# EAGLE schematic UniTerm (EAGLE 7.1.0)
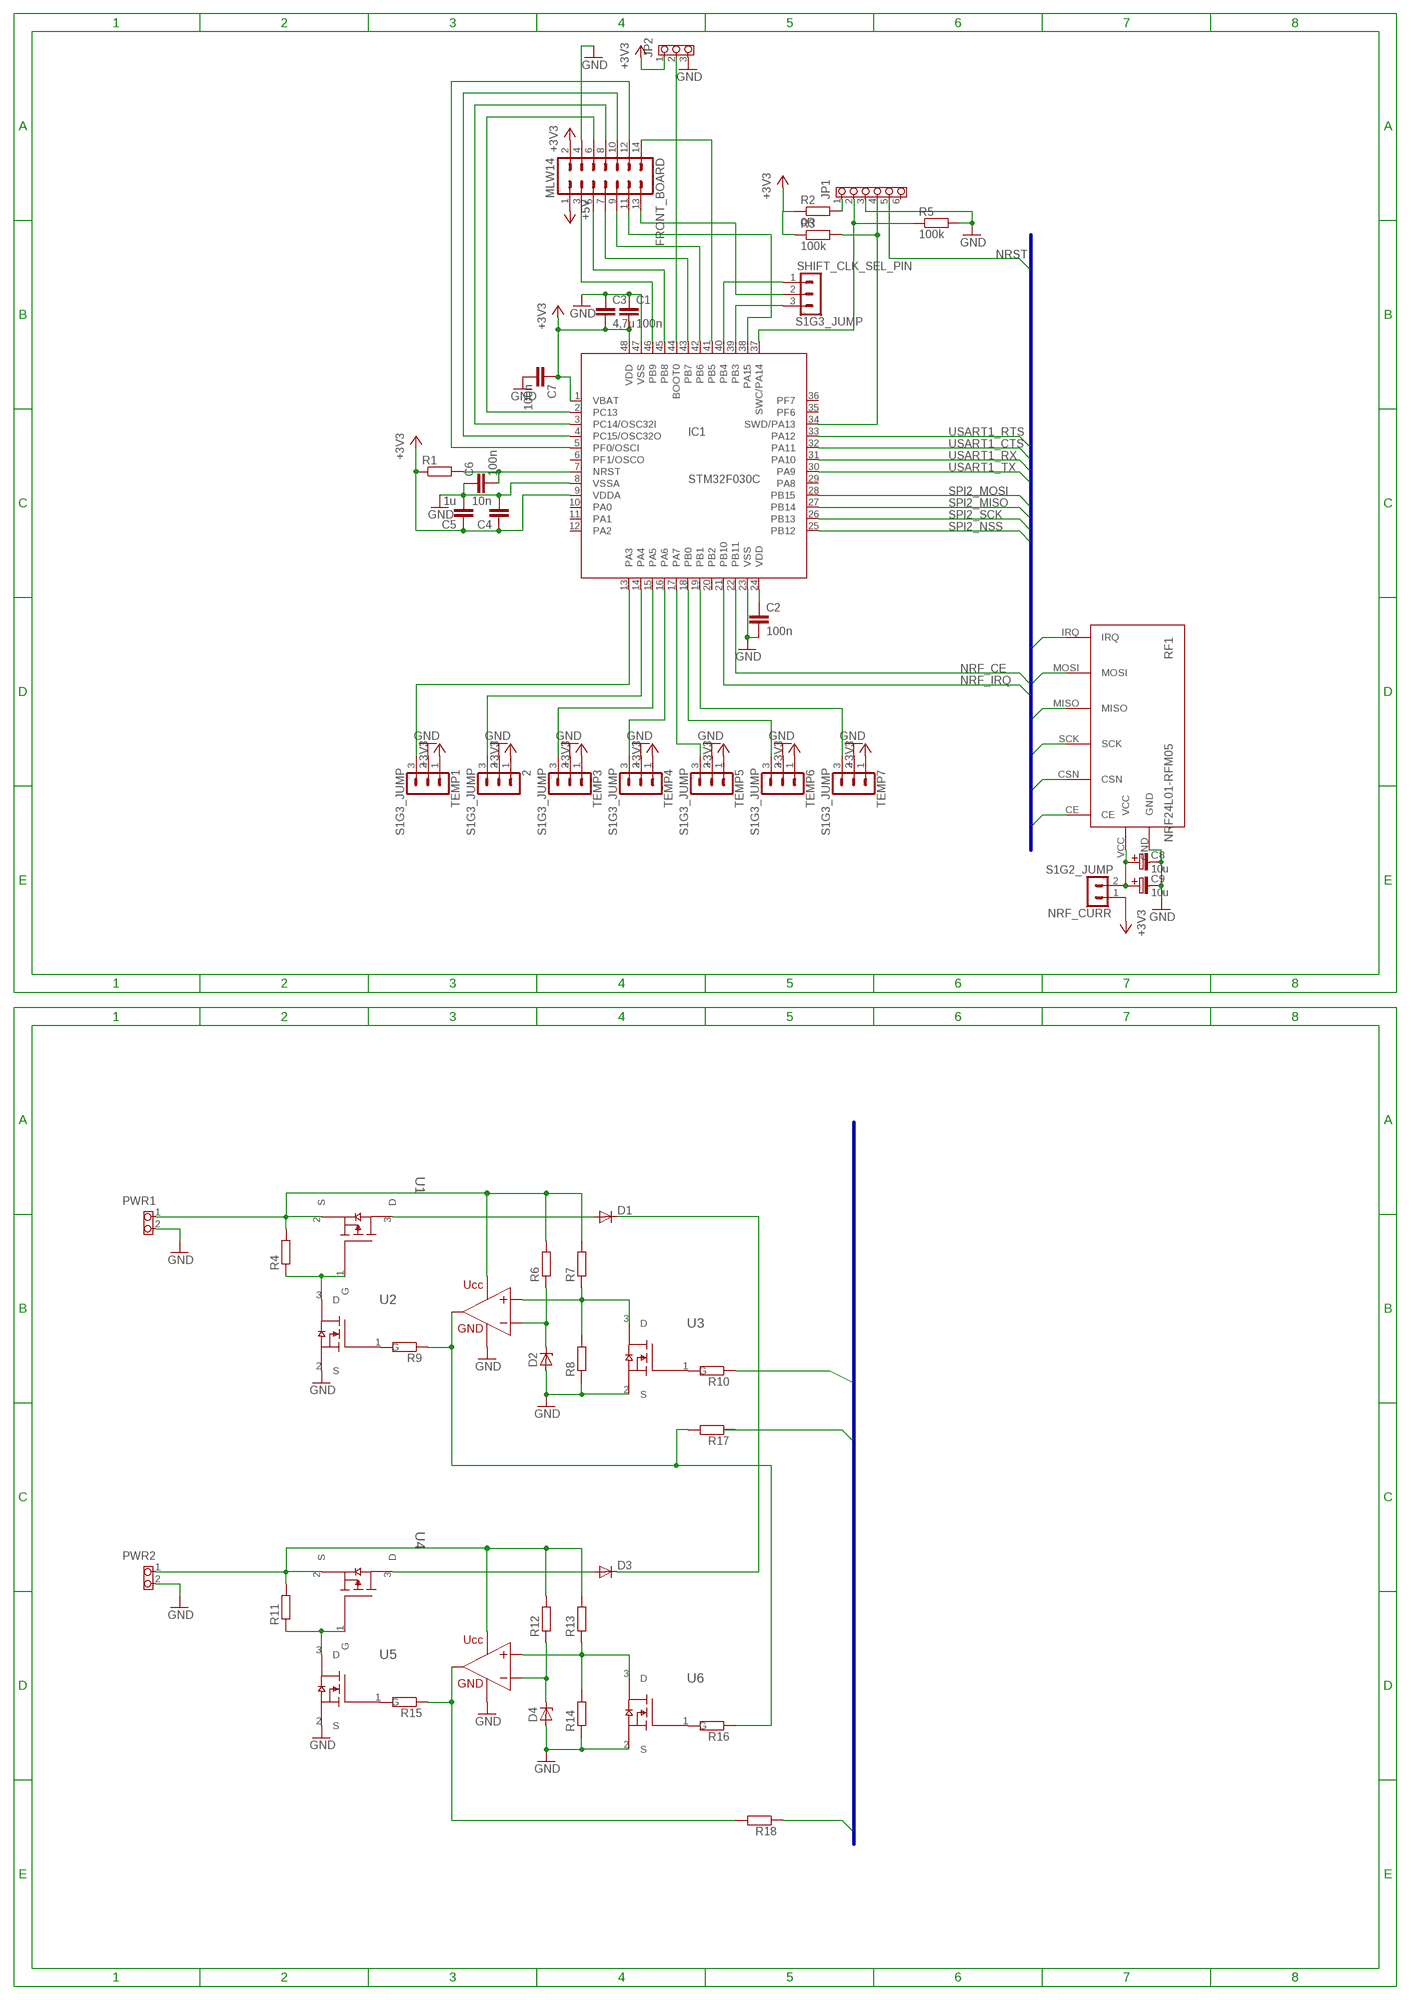
[diagram p0: schematic, sheet 1]

## Parts
2  S1G3_JUMP  [S1G3_JUM]
C1  100n  C-EUC1206  [C1206]
C2  100n  C-EUC1206  [C1206]
C3  4,7u  C-EUC1206  [C1206]
C4  10n  C-EUC1206  [C1206]
C5  1u  C-EUC1206  [C1206]
C6  100n  C-EUC1206  [C1206]
C7  100n  C-EUC1206  [C1206]
C8  10u  C-ELEKTROLYT_5  [C-EL_5]
C9  10u  C-ELEKTROLYT_5  [C-EL_5]
D1  MBR0520LT  [SOD123]
D2  ZENER-DIODESMB  [SMB]
D3  MBR0520LT  [SOD123]
D4  ZENER-DIODESMB  [SMB]
FRONT_BOARD  MLW14  [MLW14G]
IC1  STM32F030C  [LQFP48]
JP1  PINHD-1X6  [1X06_254]
JP2  PINHD-1X3  [1X03_254]
NRF_CURR  S1G2_JUMP  [S1G2_JUM]
PWR1  PINHD-1X2_508_H  [1X02_508_H]
PWR2  PINHD-1X2_508_H  [1X02_508_H]
R1  R-EU_R1206  [R1206]
R2  0R  R-EU_R1206  [R1206]
R3  100k  R-EU_R1206  [R1206]
R4  R-EU_R1206  [R1206]
R5  100k  R-EU_R1206  [R1206]
R6  R-EU_R1206  [R1206]
R7  R-EU_R1206  [R1206]
R8  R-EU_R1206  [R1206]
R9  R-EU_R1206  [R1206]
R10  R-EU_R1206  [R1206]
R11  R-EU_R1206  [R1206]
R12  R-EU_R1206  [R1206]
R13  R-EU_R1206  [R1206]
R14  R-EU_R1206  [R1206]
R15  R-EU_R1206  [R1206]
R16  R-EU_R1206  [R1206]
R17  R-EU_R1206  [R1206]
R18  R-EU_R1206  [R1206]
RF1  NRF24L01-RFM05  [NRF24L01-RFM05]
SHIFT_CLK_SEL_PIN  S1G3_JUMP  [S1G3_JUM]
TEMP1  S1G3_JUMP  [S1G3_JUM]
TEMP3  S1G3_JUMP  [S1G3_JUM]
TEMP4  S1G3_JUMP  [S1G3_JUM]
TEMP5  S1G3_JUMP  [S1G3_JUM]
TEMP6  S1G3_JUMP  [S1G3_JUM]
TEMP7  S1G3_JUMP  [S1G3_JUM]
U1  TSM2311CX  [SOT95P280X130-3N]
U2  BSS138BK  [SOT65P210X110-3N]
U3  BSS138BK  [SOT65P210X110-3N]
U4  TSM2311CX  [SOT95P280X130-3N]
U5  BSS138BK  [SOT65P210X110-3N]
U6  BSS138BK  [SOT65P210X110-3N]
U$1  SOIC8_OZ  [SOIC127P600X175-8N]
U$2  SOIC8_OZ  [SOIC127P600X175-8N]

## Nets
+3V3: 2.1 C1.2 C3.2 C4.1 C5.1 C7.1 FRONT_BOARD.1 FRONT_BOARD.2 IC1.1(VBAT) IC1.9(VDDA) IC1.48(VDD) JP2.1 NRF_CURR.1 R1.1 R2.1 R3.1 TEMP1.1 TEMP3.1 TEMP4.1 TEMP5.1 TEMP6.1 TEMP7.1 ; supply symbol labelled +5V
GND: 2.2 C1.1 C2.2 C3.1 C4.2 C5.2 C6.1 C7.2 C8.C-(C_EL-) C9.C-(C_EL-) D2.A D4.A FRONT_BOARD.4 IC1.8(VSSA) IC1.23(VSS) IC1.47(VSS) JP1.3 JP2.3 PWR1.2 PWR2.2 R5.2 R8.1 R14.1 RF1.GND TEMP1.2 TEMP3.2 TEMP4.2 TEMP5.2 TEMP6.2 TEMP7.2 U2.2(S) U3.2(S) U5.2(S) U6.2(S) U$1.4(A:P$GND) U$2.4(A:P$GND)
N$1: C6.2 IC1.7(NRST) R1.2
N$2: JP1.1 R2.2
N$3: IC1.37(SWC/PA14) JP1.2 R5.1
N$4: PWR1.1 R4.2 R6.2 R7.2 U1.2(S) U$1.8(A:P$UCC)
N$5: C2.1 IC1.24(VDD)
N$6: R4.1 U1.1(G) U2.3(D)
N$7: IC1.44(BOOT0) JP2.2
N$8: IC1.34(SWD/PA13) JP1.4 R3.2
N$9: D1.A U1.3(D)
N$10: R10.2 U3.1(G)
N$11: R9.1 R16.1 R17.2 U$1.1(A:P$A_OUT)
N$12: D2.C R6.1 U$1.2(A:P$A-)
N$13: R7.1 R8.2 U3.3(D) U$1.3(A:P$A+)
N$14: R9.2 U2.1(G)
N$15: PWR2.1 R11.2 R12.2 R13.2 U4.2(S) U$2.8(A:P$UCC)
N$16: R11.1 U4.1(G) U5.3(D)
N$17: D3.A U4.3(D)
N$18: R15.1 R18.2 U$2.1(A:P$A_OUT)
N$19: D4.C R12.1 U$2.2(A:P$A-)
N$20: R13.1 R14.2 U6.3(D) U$2.3(A:P$A+)
N$21: R15.2 U5.1(G)
N$22: R16.2 U6.1(G)
N$23: D1.C D3.C
N$24: FRONT_BOARD.14 IC1.41(PB5)
N$25: FRONT_BOARD.13 SHIFT_CLK_SEL_PIN.2
N$26: FRONT_BOARD.11 IC1.38(PA15)
N$27: FRONT_BOARD.9 IC1.42(PB6)
N$28: FRONT_BOARD.7 IC1.43(PB7)
N$29: FRONT_BOARD.5 IC1.45(PB8)
N$30: FRONT_BOARD.3 IC1.46(PB9)
N$31: IC1.40(PB4) SHIFT_CLK_SEL_PIN.1
N$32: IC1.39(PB3) SHIFT_CLK_SEL_PIN.3
N$33: FRONT_BOARD.12 IC1.5(PF0/OSCI)
N$34: FRONT_BOARD.10 IC1.4(PC15/OSC32O)
N$35: FRONT_BOARD.8 IC1.3(PC14/OSC32I)
N$36: FRONT_BOARD.6 IC1.2(PC13)
N$37: IC1.19(PB1) TEMP7.3
N$38: IC1.18(PB0) TEMP6.3
N$39: IC1.17(PA7) TEMP5.3
N$40: IC1.16(PA6) TEMP4.3
N$41: IC1.15(PA5) TEMP3.3
N$42: 2.3 IC1.14(PA4)
N$43: IC1.13(PA3) TEMP1.3
N$44: C8.C+(C_EL+) C9.C+(C_EL+) NRF_CURR.2 RF1.VCC
NRF_CE: IC1.22(PB11) RF1.CE
NRF_IRQ: IC1.21(PB10) RF1.IRQ
NRST: JP1.5
PWR2_EN: R18.1
PWR_CHANGE: R10.1
SPI2_MISO: IC1.27(PB14) RF1.MISO
SPI2_MOSI: IC1.28(PB15) RF1.MOSI
SPI2_NSS: IC1.25(PB12) RF1.CSN
SPI2_SCK: IC1.26(PB13) RF1.SCK
USART1_CTS: IC1.32(PA11)
USART1_RTS: IC1.33(PA12)
USART1_RX: IC1.31(PA10)
USART1_TX: IC1.30(PA9)
Unconnected: IC1.6(PF1/OSCO) IC1.10(PA0) IC1.11(PA1) IC1.12(PA2) IC1.20(PB2) IC1.29(PA8) IC1.35(PF6) IC1.36(PF7) JP1.6 R17.1 U$1.5(B:P$B+) U$1.6(B:P$B-) U$1.7(B:P$B_OUT) U$2.5(B:P$B+) U$2.6(B:P$B-) U$2.7(B:P$B_OUT)

## Buses
NRST,PWR1_EN,PWR2_EN,PWR_CHANGE,USART1_RTS,USART1_CTS,USART1_RX,USART1_TX,SPI2_MOSI,SPI2_MISO,SPI2_SCK,SPI2_NSS,NRF_CE,NRF_IRQ

## Library data of the parts
2 SHIFT_CLK_SEL_PIN TEMP1 TEMP3-TEMP7 = #PaJa_konektory:S1G3_JUMP: Radove konektory - koliky - 3x
C1-C7 = rcl:C-EU: CAPACITOR, European symbol
C8 C9 = #PaJa_30:C-ELEKTROLYT: Kondenzator - elektrolyticky
D1 D3 = diode:MBR0520LT: SCHOTTKY BARRIER RECTIFIER Source: http://onsemi.com .. MBR0520LT1-D.pdf
D2 D4 = diode:ZENER-DIODE: Z-Diode
FRONT_BOARD = #PaJa_konektory:MLW14: Konektory MLW - vidlice - 14x
IC1 = !ic_stm32:STM32F0*C: IO Mikrokontroler
JP1 = !pinhead:PINHD-1X6: Konektor 6 PIN Typ Rastr Imax Umax Rmax Kontakt 2.54 mm 500 mA 125 V 50 mOhm krimp /90 2.54 mm 500 mA 125 V 50 mOhm krimp _MX5267 2.50 mm 2.5 A 250 V 20 mOhm krimp _MX53048 1.25 mm 800 mA 125 V 20 mOhm krimp _PV-3.81 3.81 mm 8 A 130 V 30 mOhm ?roub
JP2 = !pinhead:PINHD-1X3: Konektor 3 PIN Typ Rastr Imax Umax Rmax Kontakt 2.54 mm 500 mA 125 V 50 mOhm krimp /90 2.54 mm 500 mA 125 V 50 mOhm krimp _MX5267 2.50 mm 2.5 A 250 V 20 mOhm krimp _MX53048 1.25 mm 800 mA 125 V 20 mOhm krimp _PV-3.81 3.81 mm 8 A 130 V 30 mOhm ?roub
NRF_CURR = #PaJa_konektory:S1G2_JUMP: Radove konektory - koliky - 2x
PWR1 PWR2 = !pinhead:PINHD-1X2: Konektor 2 PIN Typ Rastr Imax Umax Rmax Kontakt 2.54 mm 500 mA 125 V 50 mOhm krimp /90 2.54 mm 500 mA 125 V 50 mOhm krimp _MX5267 2.50 mm 2.5 A 250 V 20 mOhm krimp _MX53048 1.25 mm 800 mA 125 V 20 mOhm krimp _PV-3.81 3.81 mm 8 A 130 V 30 mOhm ?roub
R1-R18 = rcl:R-EU_: RESISTOR, European symbol
RF1 = kumen:NRF24L01: 2.4G Wireless nRF24L01+ module RFM04: http://www.elecfreaks.com/wiki/index.php?title=2.4G_Wireless_nRF24L01p RFM05: http://www.elecfreaks.com/wiki/index.php?title=2.4G_Wireless_nRF24L01p_with_PA_and_LNA
U1 U4 = Mosfets:TSM2311CX: 20V P-Channel MOSFET; MPN: TSM2311CX; OC_FARNELL: 1864586; OC_NEWARK: 27T2996; PACKAGE: SOT-23-3; SUPPLIER: TAIWAN SEMICONDUCTOR
U2 U3 U5 U6 = Mosfets:BSS138BK: N-channel Trench MOSFET; MPN: BSS138BK; OC_FARNELL: 2053833; OC_NEWARK: 61T7486; PACKAGE: SOT-23-3; SUPPLIER: NXP
U$1 U$2 = OZ:SOIC8_OZ